# Altium project led chaser.PrjPcb
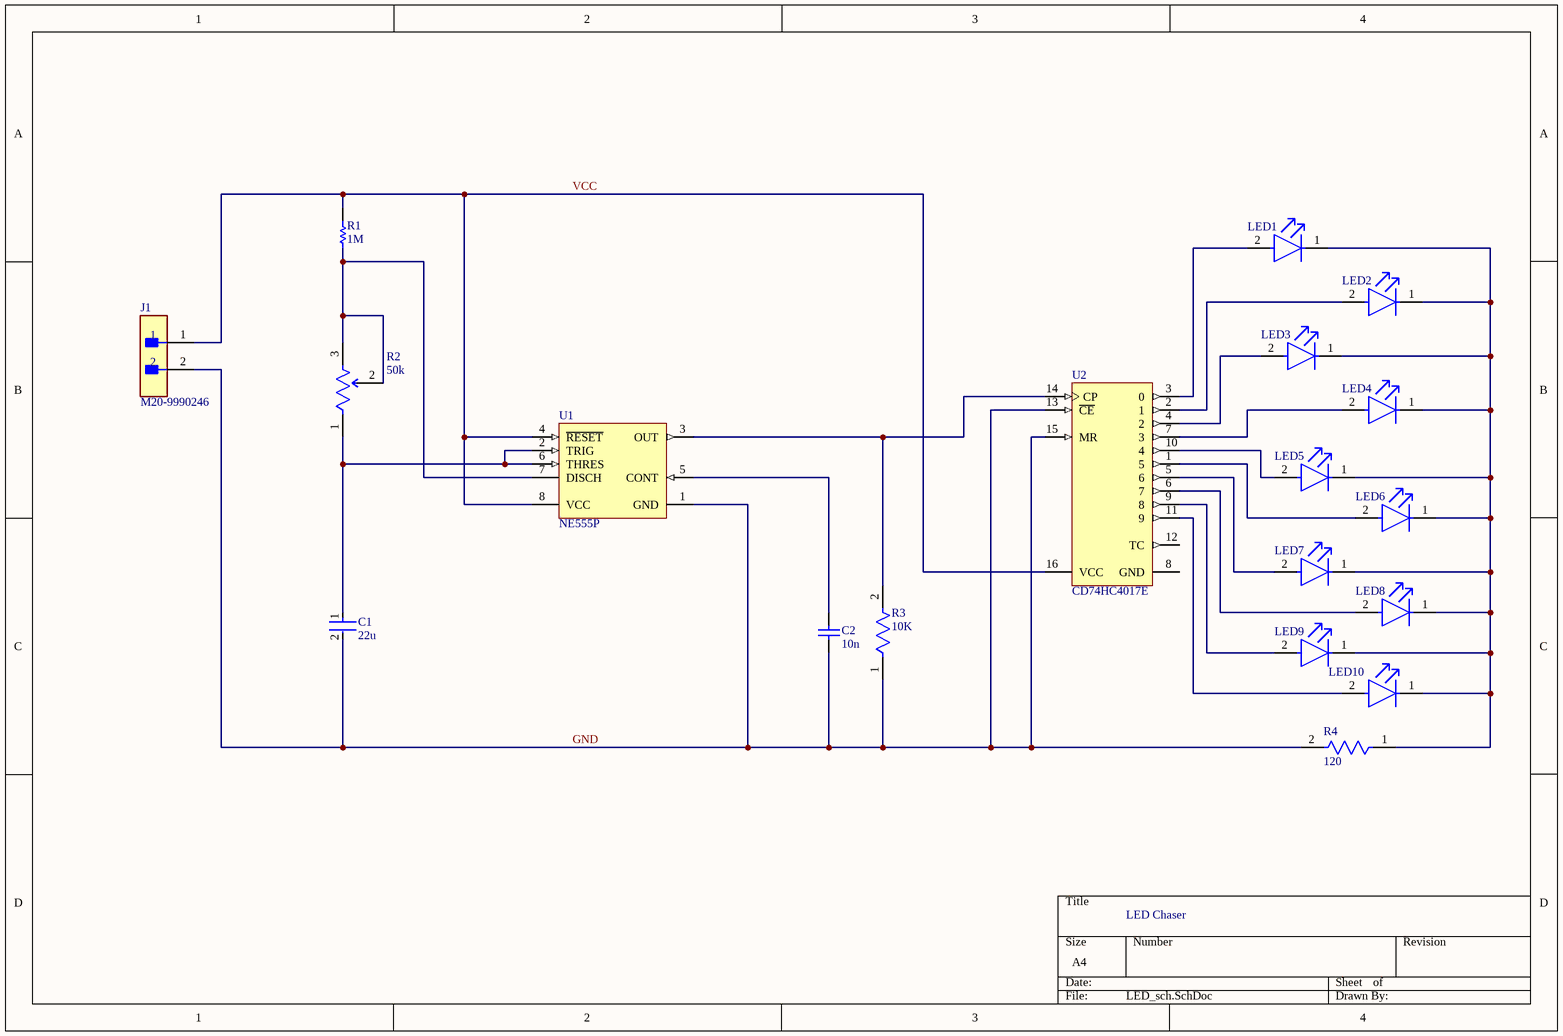
[diagram p0: LED_sch.SchDoc]
1 sheet, 19 parts. Net scope: global (net labels, ports and power ports of the same name join across sheets).
Board file: LED_pcb.PcbDoc

## Sheet LED_sch.SchDoc
size A4; SheetNumber: 1; SheetTotal: 1

### Parts
C1  22u  [FP-1206-L_3_2_0_2-W_1_6_0-IPC_C]
C2  10n  [CAPC1608X92X38NL15T08]
J1  M20-9990246  [FP-M20-9990246-MFG]
LED1  HLMP-P156-HK011  [FP-HLMP-P156-HK011-MFG]  (value not drawn)
LED2  HLMP-P156-HK011  [FP-HLMP-P156-HK011-MFG]  (value not drawn)
LED3  HLMP-P156-HK011  [FP-HLMP-P156-HK011-MFG]  (value not drawn)
LED4  HLMP-P156-HK011  [FP-HLMP-P156-HK011-MFG]  (value not drawn)
LED5  HLMP-P156-HK011  [FP-HLMP-P156-HK011-MFG]  (value not drawn)
LED6  HLMP-P156-HK011  [FP-HLMP-P156-HK011-MFG]  (value not drawn)
LED7  HLMP-P156-HK011  [FP-HLMP-P156-HK011-MFG]  (value not drawn)
LED8  HLMP-P156-HK011  [FP-HLMP-P156-HK011-MFG]  (value not drawn)
LED9  HLMP-P156-HK011  [FP-HLMP-P156-HK011-MFG]  (value not drawn)
LED10  HLMP-P156-HK011  [FP-HLMP-P156-HK011-MFG]  (value not drawn)
R1  1M  [RESA60-630X240]
R2  50k  [FP-3362P-1-503TLF-MFG]
R3  10K  [FP-MFR-12-MFG]
R4  120  [FP-MRS1600-MFG]
U1  NE555P  [P0008A]
U2  CD74HC4017E  [N0016A]

### Nets
GND: C1.2 C2.1 J1.2 R3.1 R4.2 U1.1(GND) U2.13(~{CE}) U2.15(MR)
VCC: J1.1 R1.2 U1.4(~{RESET}) U1.8(VCC) U2.16(VCC)
NetC1_1: C1.1 R2.1(CCW) U1.2(TRIG) U1.6(THRES)
NetC2_2: C2.2 U1.5(CONT)
NetLED1_1: LED1.1(C) LED2.1(C) LED3.1(C) LED4.1(C) LED5.1(C) LED6.1(C) LED7.1(C) LED8.1(C) LED9.1(C) LED10.1(C) R4.1
NetLED1_2: LED1.2(A) U2.3(0)
NetLED2_2: LED2.2(A) U2.2(1)
NetLED3_2: LED3.2(A) U2.4(2)
NetLED4_2: LED4.2(A) U2.7(3)
NetLED5_2: LED5.2(A) U2.10(4)
NetLED6_2: LED6.2(A) U2.1(5)
NetLED7_2: LED7.2(A) U2.5(6)
NetLED8_2: LED8.2(A) U2.6(7)
NetLED9_2: LED9.2(A) U2.9(8)
NetLED10_2: LED10.2(A) U2.11(9)
NetR1_1: R1.1 R2.2(WIPER) R2.3(CW) U1.7(DISCH)
NetR3_2: R3.2 U1.3(OUT) U2.14(CP)

Not connected (* = marked no-connect by the designer): U2 8(GND) 12(TC)

### Notes on the sheet
- LED Chaser

### Library data of the parts
C1 = CMP-04427-006376-1: General Purpose Ceramic Capacitor, 1206, 22uF, 10%, X5R, 15%, 6.3V; Insulation Resistance: 100GR; Dissipation Factor: 5%; Series: 1206; REACH SVHC: No SVHC; Depth: 1.6mm; Dielectric: X5R; Contact Plating: Tin; Lead Free: Lead Free; Voltage Rating (DC): 6.3V; Termination: SMD/SMT; Case/Package: 1206; Capacitance: 22uF; Max Operating Temperature: 85°C; Length: 3.2mm; Voltage Rating: 6.3V; Radiation Hardening: No; Width: 1.6mm; Package Quantity: 1; RoHS Compliant: Yes; Mount: Surface Mount; Construction: Flat; Case Code (Metric): 3216; Dielectric Material: Ceramic; Thickness: 0.07inch; Min Operating Temperature: -55°C; Tolerance: 10%; Height: 0.07mm; Voltage: 6.3V; Number of Pins: 2; Packaging: Tape and Reel; Case Code (Imperial): 1206
C2 = CMP-2006-01186-1: Part Number: VJ0603Y103KXBAC; Manufacturer: Vitramon
J1 = CMP-15831-000009-1: CONN HEADER VERT 2POS 2.54MM; Manufacturer: Harwin; Conn Gender: Male; Conn Orientation: Vertical; Number Of Contacts: 2; Current Rating: 3A; ComponentLink2URL: https://cdn.harwin.com/pdfs/M20-999.pdf; ComponentLink2Description: Datasheet; Package: M20-9990246; Temperature: -40°C to +105°C; Octopart: https://octopart.com/m20-9990246-harwin-2590635; Mouser Description: 2.54mm (0.1") Pitch SIL Vertical PC Tail Pin Header, 6.1mm mating pin height, tin, 2 contacts; Temperature Range High: +105°C; Device Class L1: Connectors; RoHS: TRUE; Automotive: No; Height: 8.99mm; Number Of Rows: 1; Contact Material: Tin,Nickel; Category: Conn; Pitch: 2.54mm; Lead Free: Yes; Digikey Description: CONN HEADER VERT 2POS 2.54MM; Manufacturer Part Number: M20-9990246; Temperature Range Low: -40°C; Device Class L3: unset; Device Class L2: Headers and Wire Housings
LED1-LED10 = CMP-18399-000014-1: LED RED CLEAR FLAT 2SMD GW; Manufacturer: Broadcom Limited; Max Junction Temp: +110°C; Led Orientation: Top View; Reverse Voltage: 5V; Viewing Angle: 75°; Power Dissipation: 100mW; Peak Emmision Wavelength: 640nm; Wavelength: 630nm; Luminous Intensity: 2.5mcd; Forward Current: 0.5mA; Forward Voltage: 1.7V; Ipc Land Pattern Name: DIOAD542W80L221D234; ComponentLink2Description: Datasheet; Octopart: https://octopart.com/hlmp-p156-hk011-broadcom-78782124; Colour: Red; Temperature Range High: +100°C; ComponentLink2URL: https://docs.broadcom.com/docs/AV02-3610EN; Temperature Range Low: -55°C; Lead Free: Yes; Temperature: -55°C to +100°C; Package: HLMP-P156-HK011; Manufacturer Part Number: HLMP-P156-HK011; Digikey Description: LED RED CLEAR FLAT 2SMD GW; Device Class L2: LEDs; Device Class L3: unset; Device Class L1: Optoelectronics; Category: Diode; RoHS: TRUE; Height: 2.44mm; Automotive: No
R1 = CMP-1659-00070-1: Axial Resistor, 1 MOhm, +/- 1%, 250 mW, -55 to 155 degC, 2-Pin THD, RoHS, Bulk; Power Rating: 250 mW; Resistance: 47.5 kohm; Voltage Rating: 250 V; ComponentLink1Description: Manufacturer URL; PackageReference: MFR-25; ComponentLink2Description: Datasheet; ComponentLink2URL: http://www.yageo.com/documents/recent/Yageo%20LR_MFR_2013.pdf; Tolerance: 1%; DatasheetVersion: Apr-13; Package Quantity: 200; Packaging: Bulk; Case\Package: Axial; RoHSCompliant: true; ComponentLink1URL: http://www.yageo.com/; Length: 0.248 inch; Min Operating Temperature: -55 degC; Mount: Through Hole; PackageDescription: 2-Pin Axial Lead, Dia 2.4 mm, Body Length 6.3 mm; Max Operating Temperature: 155 degC
R2 = CMP-07234-000028-1: TRIMMER 50K OHM 0.5W PC PIN TOP; Temperature Coefficient: 100ppm/°C; Voltage Rating (DC): 300V; Resistance: 50kR; Power Rating: 500mW; Tolerance: 10%; Number of Turns: 1; Series: Trimpot® 3362 - Sealed; Military Standard: Not; Termination: Pin; Technology: CERMET; Depth: 7.04mm; RoHS Compliant: Yes; Max Operating Temperature: 125°C; Lead Free: Lead Free; Max Power Dissipation: 500mW; REACH SVHC: No SVHC; Min Operating Temperature: -55°C; Resistor Type: Cermet; Height: 0.185inch; Width: 4.7mm; Mount: Through Hole; Weight: 0.02oz; Length: 6.6mm; Resistance Tolerance: 10%; Package Quantity: 50; Radiation Hardening: No; Packaging: Rail/Tube
R3 = CMP-03413-000012-1: RES MF 1/6W 1% AXIAL; Power Rating: 160mW; Voltage Rating (DC): 200V; Resistance: 10kR; Min Operating Temperature: -55°C; Max Operating Temperature: 155°C; Voltage Rating: 200V; Termination: Axial; Packaging: Ammo Pack; Tolerance: 1%
R4 = CMP-02408-000036-1: RES 120 OHM 1% 0.4W AXIAL; Temperature Coefficient: 50ppm/°C; Resistance: 120R; Power Rating: 400mW; Max Operating Temperature: 155°C; Length: 3.6mm; Tolerance: 1%; Mount: Through Hole; Construction: Cylindrical; Contact Plating: Tin; Diameter: 1.6mm; Case/Package: Conformal; Military Standard: Not; Lead Free: Lead Free; Resistor Type: Thin Film; Termination: Axial; Min Operating Temperature: -55°C; Width: 1.6mm; Radiation Hardening: No; Series: MRS16; Technology: THIN FILM; RoHS Compliant: Yes
U1 = CMP-2000-04954-1: Precision Timer, 4.5 to 16 V, 0 to 70 degC, 8-Pin DIP, Pb-Free, Tube; Manufacturer: TexasInstruments; Maximum High Level Output Current: -200mA; Number of Internal Timers: 1; Operating Supply Voltage: 5; Maximum Low Level Output Current: 200mA; Rad Hard: No; Packaging: Rail/Tube; Manufacturer URL: http://www.ti.com/; Package Reference: P8; Package Description: 8-Pin Double In-line Package, Body 9.59 x 6.35 mm, Pitch 2.54 mm; Package URL: http://www.ti.com/lit/ml/mpdi001b/mpdi001b.pdf; Type: Standard; Datasheet URL: http://www.ti.com/general/docs/lit/getliterature.tsp?genericPartNumber=NE555&fileType=pdf; Category: Timer; Package: 8PDIP; Datasheet Version: Rev. I, 09/2014
U2 = CMP-1623-00548-2: High Speed CMOS Logic Decade Counter/Divider with 10 Decoded Outputs, N0016A, TUBE; Manufacturer: Texas Instruments; tpd @ Nom Voltage(Max)(ns): 54; Inputs: 1; Input Type: LVTTL/CMOS; Voltage(Nom)(V): 3.3,5; Schmitt Trigger: No; Output Drive (IOL/IOH)(Max)(mA): 5.2/-5.2; Bits(#): 10; VCC(Max)(V): 6; Technology Family: HC; ICC @ Nom Voltage(Max)(mA): 0.08; Rating: Catalog; F @ Nom Voltage(Max)(Mhz): 28; VCC(Min)(V): 2; Generic Part Number: CD74HC4017; Code_JEDEC: MS-001; DatasheetVersion: SCHS200D; Output Type: CMOS; Type: Decade; Operating Temperature Range(C): -55 to 125; PackageReference: N0016A; Function: Counter